# Altium schematic sheet breakout_HTSSOP.SchDoc
size A
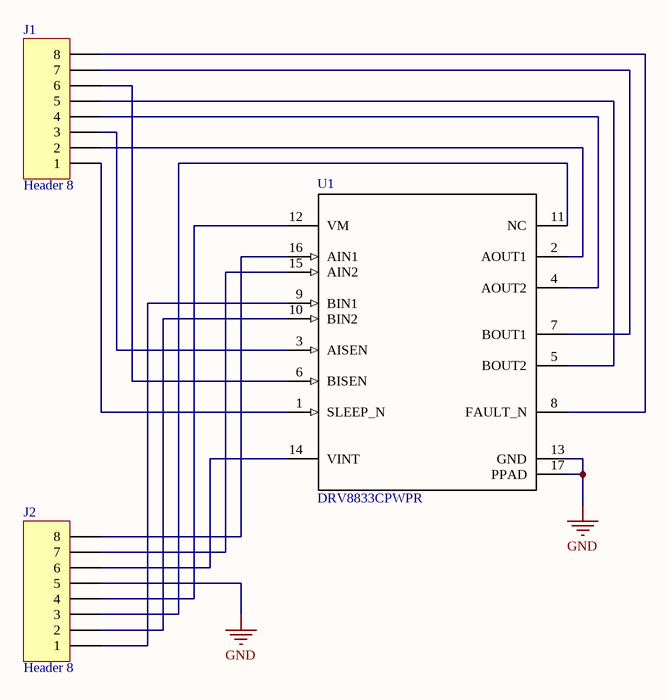
[diagram p0: breakout_HTSSOP.SchDoc]

## Parts
J1  Header 8  [HDR1X8]
J2  Header 8  [HDR1X8]
U1  DRV8833CPWPR  [htssop16]

## Nets
GND: J2.5 U1.13(GND) U1.17(PPAD)
NetJ1_1: J1.1 U1.1(SLEEP_N)
NetJ1_2: J1.2 U1.2(AOUT1)
NetJ1_3: J1.3 U1.3(AISEN)
NetJ1_4: J1.4 U1.4(AOUT2)
NetJ1_5: J1.5 U1.5(BOUT2)
NetJ1_6: J1.6 U1.6(BISEN)
NetJ1_7: J1.7 U1.7(BOUT1)
NetJ1_8: J1.8 U1.8(FAULT_N)
NetJ2_1: J2.1 U1.9(BIN1)
NetJ2_2: J2.2 U1.10(BIN2)
NetJ2_3: J2.3 U1.11(NC)
NetJ2_4: J2.4 U1.12(VM)
NetJ2_6: J2.6 U1.14(VINT)
NetJ2_7: J2.7 U1.15(AIN2)
NetJ2_8: J2.8 U1.16(AIN1)

## Library data of the parts
J1 J2 = Header 8: Header, 8-Pin; LatestRevisionDate: 17-Jul-2002; LatestRevisionNote: Re-released for DXP Platform.; Publisher: Altium Limited
U1 = DRV8833CPWPR: Imported; Manufacturer: Texas Instruments; CompType: IC; PIN_COUNT: 17; Application_BuildNumber: *; PartNumber: DRV8833CPWPR; Alternate PartNumber: DRV8833CPWP; PackageReference: PWP0016K; MountType: SMT; RoHS: Y; RefDes: RefDes; Type: DEV; Value: Value